# Altium schematic sheet KeyInput_ABH.SchDoc
size A4
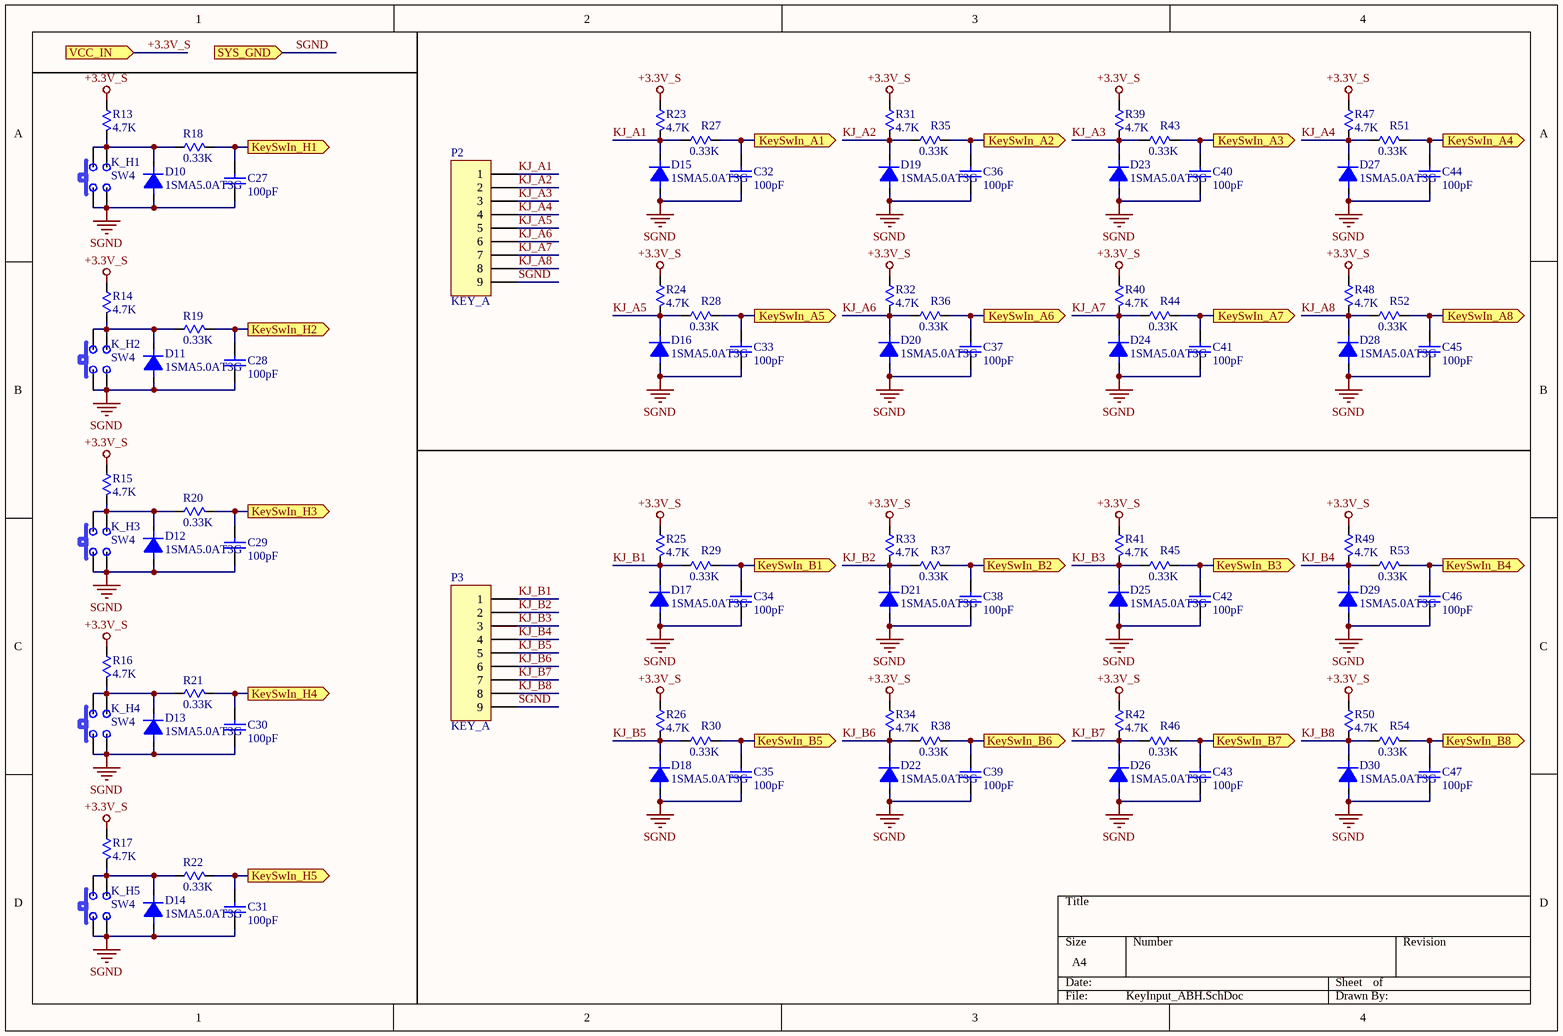
[diagram p0: KeyInput_ABH.SchDoc]

## Parts
C27  100pF  [C0805]
C28  100pF  [C0805]
C29  100pF  [C0805]
C30  100pF  [C0805]
C31  100pF  [C0805]
C32  100pF  [C0805]
C33  100pF  [C0805]
C34  100pF  [C0805]
C35  100pF  [C0805]
C36  100pF  [C0805]
C37  100pF  [C0805]
C38  100pF  [C0805]
C39  100pF  [C0805]
C40  100pF  [C0805]
C41  100pF  [C0805]
C42  100pF  [C0805]
C43  100pF  [C0805]
C44  100pF  [C0805]
C45  100pF  [C0805]
C46  100pF  [C0805]
C47  100pF  [C0805]
D10  1SMA5.0AT3G  [SMA]
D11  1SMA5.0AT3G  [SMA]
D12  1SMA5.0AT3G  [SMA]
D13  1SMA5.0AT3G  [SMA]
D14  1SMA5.0AT3G  [SMA]
D15  1SMA5.0AT3G  [SMA]
D16  1SMA5.0AT3G  [SMA]
D17  1SMA5.0AT3G  [SMA]
D18  1SMA5.0AT3G  [SMA]
D19  1SMA5.0AT3G  [SMA]
D20  1SMA5.0AT3G  [SMA]
D21  1SMA5.0AT3G  [SMA]
D22  1SMA5.0AT3G  [SMA]
D23  1SMA5.0AT3G  [SMA]
D24  1SMA5.0AT3G  [SMA]
D25  1SMA5.0AT3G  [SMA]
D26  1SMA5.0AT3G  [SMA]
D27  1SMA5.0AT3G  [SMA]
D28  1SMA5.0AT3G  [SMA]
D29  1SMA5.0AT3G  [SMA]
D30  1SMA5.0AT3G  [SMA]
K_H1  SW4  [SW-MEC]
K_H2  SW4  [SW-MEC]
K_H3  SW4  [SW-MEC]
K_H4  SW4  [SW-MEC]
K_H5  SW4  [SW-MEC]
P2  KEY_A  [HDR1X9]
P3  KEY_A  [HDR1X9]
R13  4.7K  [R0805]
R14  4.7K  [R0805]
R15  4.7K  [R0805]
R16  4.7K  [R0805]
R17  4.7K  [R0805]
R18  0.33K  [R0805]
R19  0.33K  [R0805]
R20  0.33K  [R0805]
R21  0.33K  [R0805]
R22  0.33K  [R0805]
R23  4.7K  [R0805]
R24  4.7K  [R0805]
R25  4.7K  [R0805]
R26  4.7K  [R0805]
R27  0.33K  [R0805]
R28  0.33K  [R0805]
R29  0.33K  [R0805]
R30  0.33K  [R0805]
R31  4.7K  [R0805]
R32  4.7K  [R0805]
R33  4.7K  [R0805]
R34  4.7K  [R0805]
R35  0.33K  [R0805]
R36  0.33K  [R0805]
R37  0.33K  [R0805]
R38  0.33K  [R0805]
R39  4.7K  [R0805]
R40  4.7K  [R0805]
R41  4.7K  [R0805]
R42  4.7K  [R0805]
R43  0.33K  [R0805]
R44  0.33K  [R0805]
R45  0.33K  [R0805]
R46  0.33K  [R0805]
R47  4.7K  [R0805]
R48  4.7K  [R0805]
R49  4.7K  [R0805]
R50  4.7K  [R0805]
R51  0.33K  [R0805]
R52  0.33K  [R0805]
R53  0.33K  [R0805]
R54  0.33K  [R0805]

## Ports
KeySwIn_A1 (out), KeySwIn_A2 (out), KeySwIn_A3 (out), KeySwIn_A4 (out), KeySwIn_A5 (out), KeySwIn_A6 (out), KeySwIn_A7 (out), KeySwIn_A8 (out), KeySwIn_B1 (out), KeySwIn_B2 (out), KeySwIn_B3 (out), KeySwIn_B4 (out), KeySwIn_B5 (out), KeySwIn_B6 (out), KeySwIn_B7 (out), KeySwIn_B8 (out), KeySwIn_H1 (out), KeySwIn_H2 (out), KeySwIn_H3 (out), KeySwIn_H4 (out), KeySwIn_H5 (out), SYS_GND (in), VCC_IN (in)

## Nets
+3.3V_S: R13.2 R14.2 R15.2 R16.2 R17.2 R23.2 R24.2 R25.2 R26.2 R31.2 R32.2 R33.2 R34.2 R39.2 R40.2 R41.2 R42.2 R47.2 R48.2 R49.2 R50.2 ; port VCC_IN
SGND: C27.2 C28.2 C29.2 C30.2 C31.2 C32.2 C33.2 C34.2 C35.2 C36.2 C37.2 C38.2 C39.2 C40.2 C41.2 C42.2 C43.2 C44.2 C45.2 C46.2 C47.2 D10.1(A) D11.1(A) D12.1(A) D13.1(A) D14.1(A) D15.1(A) D16.1(A) D17.1(A) D18.1(A) D19.1(A) D20.1(A) D21.1(A) D22.1(A) D23.1(A) D24.1(A) D25.1(A) D26.1(A) D27.1(A) D28.1(A) D29.1(A) D30.1(A) K_H1.1 K_H2.1 K_H3.1 K_H4.1 K_H5.1 P2.9 P3.9 ; port SYS_GND
KeySwIn_A1: C32.1 R27.1 ; port KeySwIn_A1
KeySwIn_A2: C36.1 R35.1 ; port KeySwIn_A2
KeySwIn_A3: C40.1 R43.1 ; port KeySwIn_A3
KeySwIn_A4: C44.1 R51.1 ; port KeySwIn_A4
KeySwIn_A5: C33.1 R28.1 ; port KeySwIn_A5
KeySwIn_A6: C37.1 R36.1 ; port KeySwIn_A6
KeySwIn_A7: C41.1 R44.1 ; port KeySwIn_A7
KeySwIn_A8: C45.1 R52.1 ; port KeySwIn_A8
KeySwIn_B1: C34.1 R29.1 ; port KeySwIn_B1
KeySwIn_B2: C38.1 R37.1 ; port KeySwIn_B2
KeySwIn_B3: C42.1 R45.1 ; port KeySwIn_B3
KeySwIn_B4: C46.1 R53.1 ; port KeySwIn_B4
KeySwIn_B5: C35.1 R30.1 ; port KeySwIn_B5
KeySwIn_B6: C39.1 R38.1 ; port KeySwIn_B6
KeySwIn_B7: C43.1 R46.1 ; port KeySwIn_B7
KeySwIn_B8: C47.1 R54.1 ; port KeySwIn_B8
KeySwIn_H1: C27.1 R18.1 ; port KeySwIn_H1
KeySwIn_H2: C28.1 R19.1 ; port KeySwIn_H2
KeySwIn_H3: C29.1 R20.1 ; port KeySwIn_H3
KeySwIn_H4: C30.1 R21.1 ; port KeySwIn_H4
KeySwIn_H5: C31.1 R22.1 ; port KeySwIn_H5
KJ_A1: D15.2(K) P2.1 R23.1 R27.2
KJ_A2: D19.2(K) P2.2 R31.1 R35.2
KJ_A3: D23.2(K) P2.3 R39.1 R43.2
KJ_A4: D27.2(K) P2.4 R47.1 R51.2
KJ_A5: D16.2(K) P2.5 R24.1 R28.2
KJ_A6: D20.2(K) P2.6 R32.1 R36.2
KJ_A7: D24.2(K) P2.7 R40.1 R44.2
KJ_A8: D28.2(K) P2.8 R48.1 R52.2
KJ_B1: D17.2(K) P3.1 R25.1 R29.2
KJ_B2: D21.2(K) P3.2 R33.1 R37.2
KJ_B3: D25.2(K) P3.3 R41.1 R45.2
KJ_B4: D29.2(K) P3.4 R49.1 R53.2
KJ_B5: D18.2(K) P3.5 R26.1 R30.2
KJ_B6: D22.2(K) P3.6 R34.1 R38.2
KJ_B7: D26.2(K) P3.7 R42.1 R46.2
KJ_B8: D30.2(K) P3.8 R50.1 R54.2
NetD10_2: D10.2(K) K_H1.2 R13.1 R18.2
NetD11_2: D11.2(K) K_H2.2 R14.1 R19.2
NetD12_2: D12.2(K) K_H3.2 R15.1 R20.2
NetD13_2: D13.2(K) K_H4.2 R16.1 R21.2
NetD14_2: D14.2(K) K_H5.2 R17.1 R22.2

## Library data of the parts
C27-C47 = Cap: Capacitor; Value: 22pF; Published: 8-Jun-2000; Revision: July-2002: Re-released for DXP Platform.; Publisher: Altium Limited
D10-D30 = DIODE1: Diode
K_H1-K_H5 = SW-key
P2 P3 = Header 9: Header, 9-Pin; LatestRevisionDate: 17-Jul-2002; LatestRevisionNote: Re-released for DXP Platform.; Publisher: Altium Limited
R13-R54 = RES: Resistor; Published: 8-Jun-2000; LatestRevisionDate: 17-Jul-2002; LatestRevisionNote: Re-released for DXP Platform.; PackageReference: AXIAL-0.3; Publisher: Altium Limited
  R13-R17 R23-R26 R31-R34 R39-R42 R47-R50: Value: 4.7K
  R18-R22 R27-R30 R35-R38 R43-R46 R51-R54: Value: 0.33K